# Altium schematic sheet IO Peripherals.SchDoc
size A4; DocumentNumber: 6; Revision: C.1(PCB.SCH); SheetNumber: 6; SheetTotal: 6
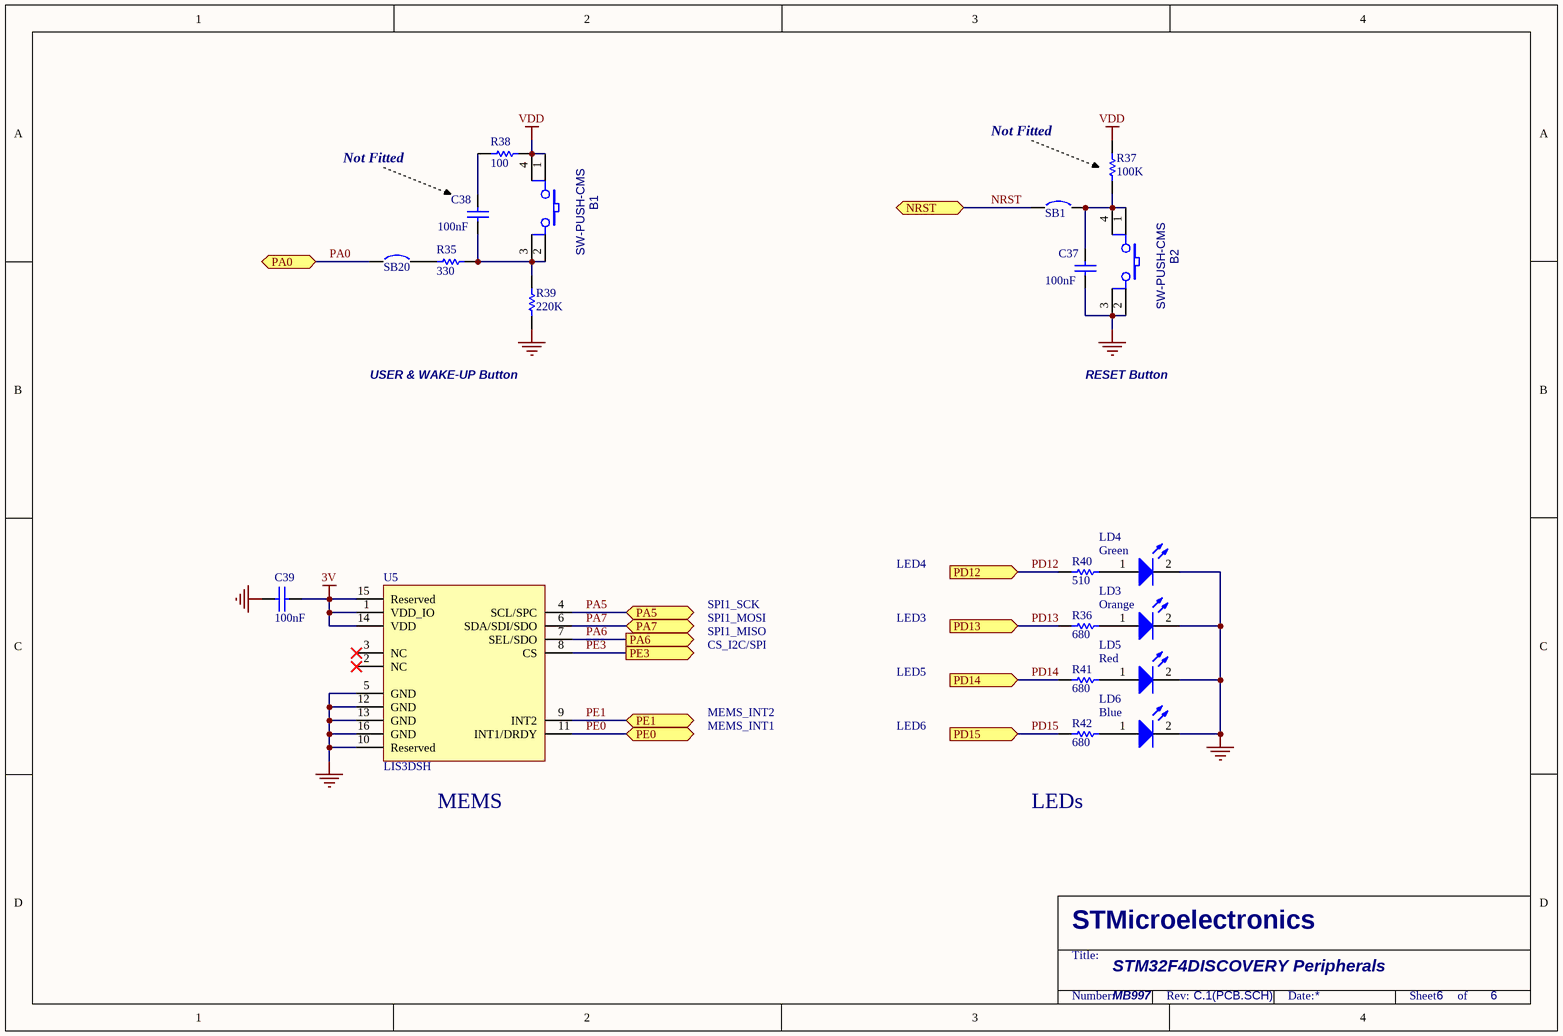
[diagram p0: IO Peripherals.SchDoc]

## Parts
B1  SW-PUSH-CMS  [BP1CMS]
B2  SW-PUSH-CMS  [BP1CMS]
C37  100nF  [0603C]
C38  100nF  [0603C]
C39  100nF  [0402C]
LD3  Orange  [0603D]
LD4  Green  [0603D]
LD5  Red  [0603D]
LD6  Blue  [0603D]
R35  330  [0402R]
R36  680  [0603R]
R37  100K  [0402R]
R38  100  [0402R]
R39  220K  [0603R]
R40  510  [0603R]
R41  680  [0603R]
R42  680  [0603R]
SB1  Circuit Breaker  [JP2_SMD]  (value not drawn)
SB20  Circuit Breaker  [JP2_SMD]  (value not drawn)
U5  LIS3DSH  [LGA16(3*3)]

## Ports
NRST, PA0, PA5 (bidir), PA6 (out), PA7 (bidir), PD12 (in), PD13 (in), PD14 (in), PD15 (in), PE0, PE1, PE3 (out)

## Nets
3V: C39.2 U5.1(VDD_IO) U5.14(VDD) U5.15(Reserved)
GND: B2.2 B2.3 C37.1 C39.1 LD3.2(K) LD4.2(K) LD5.2(K) LD6.2(K) R39.1 U5.5(GND) U5.10(Reserved) U5.12(GND) U5.13(GND) U5.16(GND)
VDD: B1.1 B1.4 R37.2 R38.2
NRST: SB1.1 ; port NRST
PA0: SB20.1 ; port PA0
PA5: U5.4(SCL/SPC) ; port PA5
PA6: U5.7(SEL/SDO) ; port PA6
PA7: U5.6(SDA/SDI/SDO) ; port PA7
PD12: R40.2 ; port PD12
PD13: R36.2 ; port PD13
PD14: R41.2 ; port PD14
PD15: R42.2 ; port PD15
PE0: U5.11(INT1/DRDY) ; port PE0
PE1: U5.9(INT2) ; port PE1
PE3: U5.8(CS) ; port PE3
NetB1_2: B1.2 B1.3 C38.1 R35.2 R39.2
NetB2_1: B2.1 B2.4 C37.2 R37.1 SB1.2
NetC38_2: C38.2 R38.1
NetLD3_1: LD3.1(A) R36.1
NetLD4_1: LD4.1(A) R40.1
NetLD5_1: LD5.1(A) R41.1
NetLD6_1: LD6.1(A) R42.1
NetR35_1: R35.1 SB20.2

Not connected (* = marked no-connect by the designer): U5 2(NC)* 3(NC)*

## Notes on the sheet
- Not Fitted
- USER & WAKE-UP Button
- RESET Button
- LED4
- SPI1_MOSI
- SPI1_SCK
- SPI1_MISO
- CS_I2C/SPI
- LED3
- MEMS_INT2
- LED5
- MEMS_INT1
- LED6
- (near U5) MEMS
- LEDs
- STM32F4DISCOVERY Peripherals
- MB997
- STMicroelectronics
- Title:
- Number:
- Rev:
- Date:
- Sheet       of

## Library data of the parts
B1 B2 = SW-PUSH-CMS: Non-Open Push-Button 0.1A 24V; Manuf_1: FARNELL; Manuf_Part_1: 535-930; Ref St: 9180120; cap_dec: ---
C37 C39 = CAP: Capacitor
  C37: Published: 8-Jun-2000; Revision: July-2002: Re-released for DXP Platform.; Publisher: Altium Limited; Value: 100nF
C38 = CAP: Capacitor; Fitted: NO; Published: 8-Jun-2000; Revision: July-2002: Re-released for DXP Platform.; Publisher: Altium Limited; Value: 100nF
LD3-LD6 = LED2: Typical RED, GREEN, YELLOW, AMBER GaAs LED; Published: 8-Jun-2000; Revision: July-2002: Re-released for DXP Platform.; Publisher: Altium Limited
R35 = res1: Resistor; Published: 8-Jun-2000; Revision: July-2002: Re-released for DXP Platform.; Publisher: Altium Limited; Value: 330
R36 R40-R42 = Res1: Resistor; Value: 1K; Published: 8-Jun-2000; Revision: July-2002: Re-released for DXP Platform.; Publisher: Altium Limited
R37 = res1: Resistor; Fitted: NO; Published: 8-Jun-2000; Revision: July-2002: Re-released for DXP Platform.; Publisher: Altium Limited; Value: 100K
R38 = res1: Resistor; Value: 330; Published: 8-Jun-2000; Revision: July-2002: Re-released for DXP Platform.; Publisher: Altium Limited
R39 = res1: Resistor; Value: 10K; Published: 8-Jun-2000; Revision: July-2002: Re-released for DXP Platform.; Publisher: Altium Limited
SB1 SB20 = Circuit Breaker: Solder: YES; Published: 24-Mar-1999; Revision: July-2002: Re-released for DXP Platform.; Publisher: Altium Limited
U5 = LIS3DSH: MEMS motion sensor 3-axis - ±2g/±4g/±6g/±8g/±16g digital output accelerometer; Manuf_1: STM; Manuf_Part_1: LIS3DSHTR; Provided: ST; Description: MEMS motion sensor 3-axis - ±2g to ±16g digital output accelerometer; ref St: to be created; Distrib: STM; Order: LIS3DSHTR